# EAGLE design Debug Module (EAGLE 6.3)
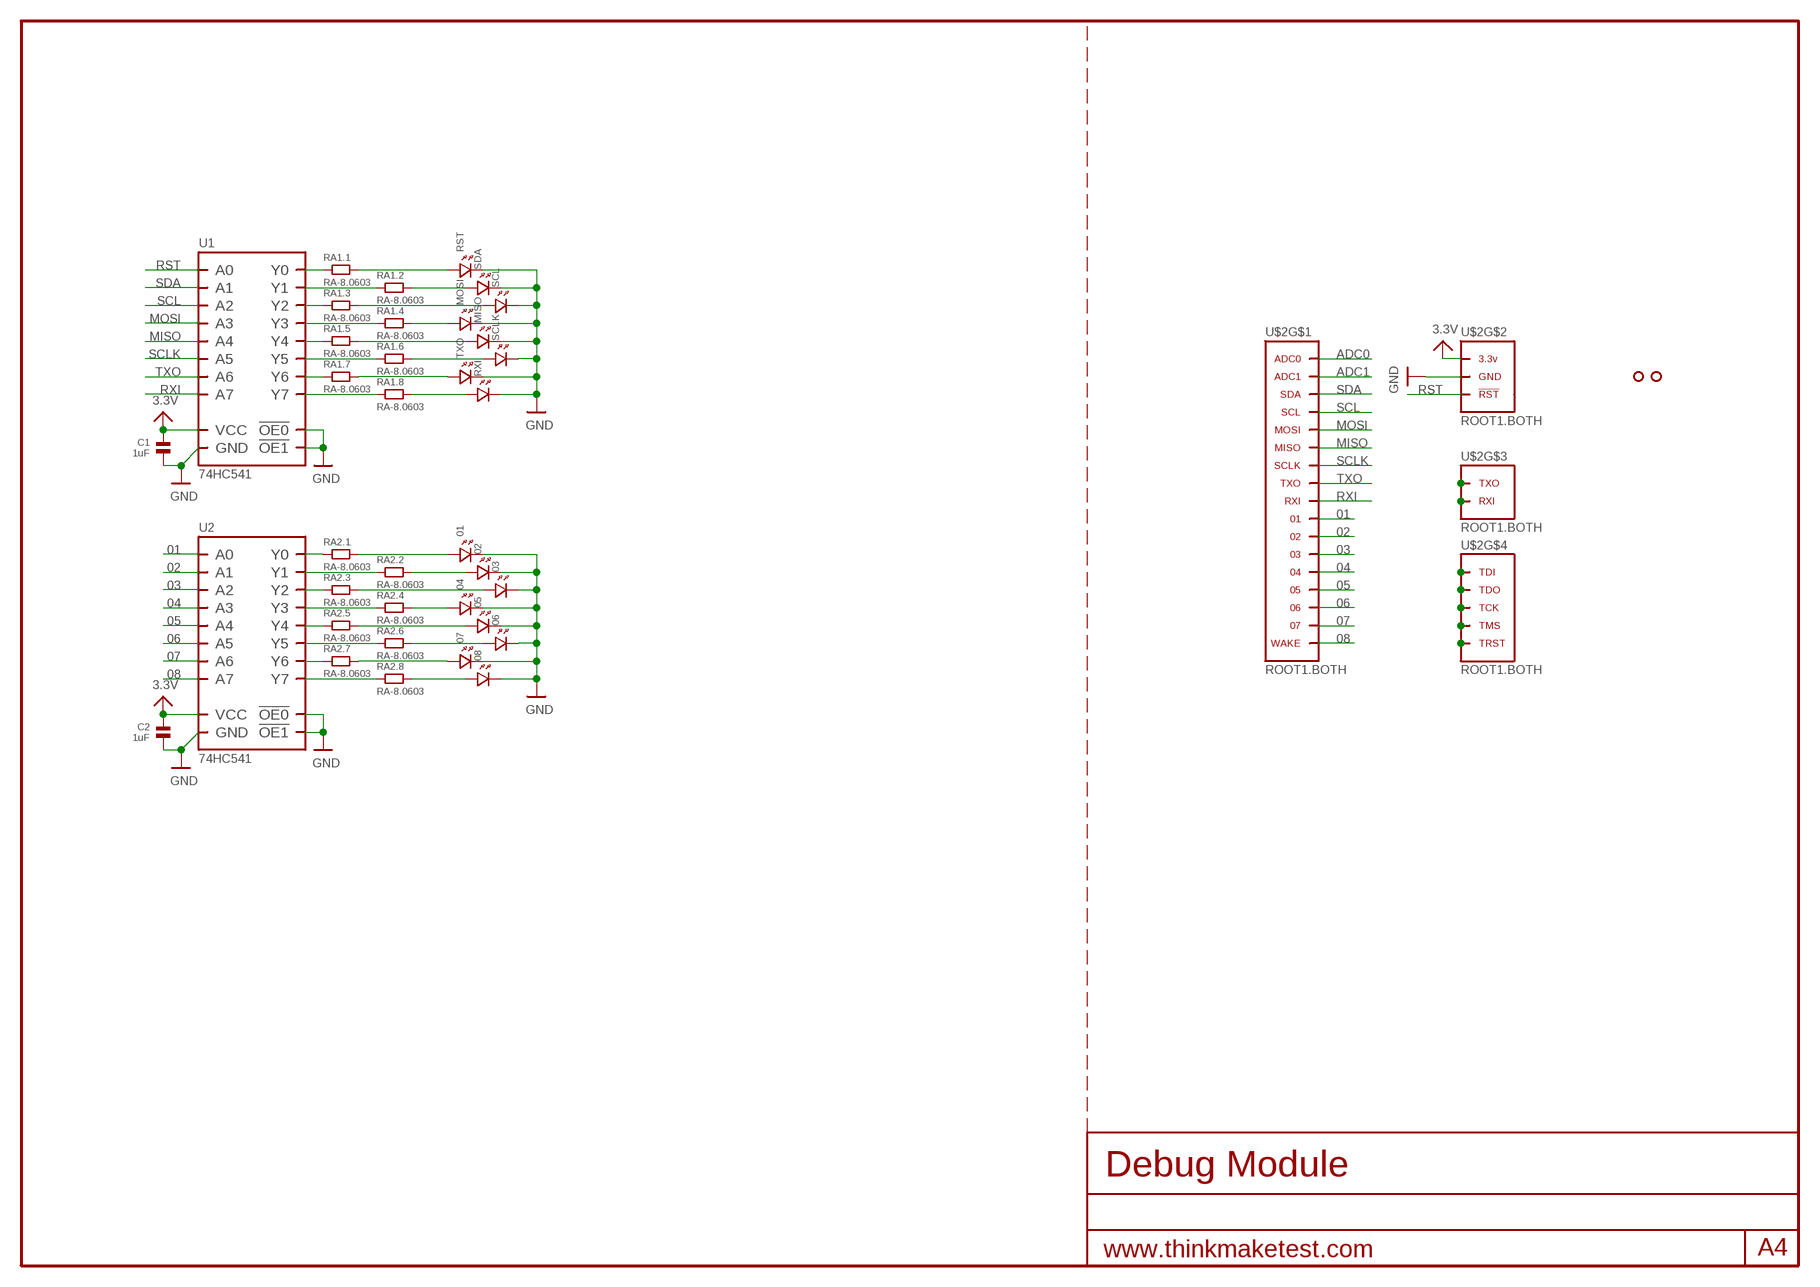
[diagram p0: schematic, sheet 1]

## Parts
01  LED.0603  [0603.LED]
02  LED.0603  [0603.LED]
03  LED.0603  [0603.LED]
04  LED.0603  [0603.LED]
05  LED.0603  [0603.LED]
06  LED.0603  [0603.LED]
07  LED.0603  [0603.LED]
08  LED.0603  [0603.LED]
C1  1uF  CAPACITOR.0603  [0603]
C2  1uF  CAPACITOR.0603  [0603]
MISO  LED.0603  [0603.LED]
MOSI  LED.0603  [0603.LED]
RA1  RA-8.0603  [0603.8.C]
RA2  RA-8.0603  [0603.8.C]
RST  LED.0603  [0603.LED]
RXI  LED.0603  [0603.LED]
SCL  LED.0603  [0603.LED]
SCLK  LED.0603  [0603.LED]
SDA  LED.0603  [0603.LED]
TXO  LED.0603  [0603.LED]
U1  74HC541  [DHVQFN20]
U2  74HC541  [DHVQFN20]
U$2  ROOT1.BOTH  [ROOT1.BOTH]
U$3  HOLE.2MM  [2MM]
U$4  HOLE.2MM  [2MM]

## Nets
01: U2.2(A0) U$2.01 U$2.01@1 U$2.01@VIA
02: U2.3(A1) U$2.02 U$2.02@1 U$2.02@VIA
03: U2.4(A2) U$2.03 U$2.03@1 U$2.03@VIA
3.3V: C1.1 C2.1 U1.20(VCC) U2.20(VCC) U$2.3.3V@1(3.3V) U$2.3.3V@2(3.3V) U$2.3.3V@3(3.3V) U$2.3.3V@4(3.3V) U$2.3.3V@5(3.3V) U$2.3.3V@6(3.3V) U$2.3.3V@7(3.3V) U$2.3.3V@8(3.3V) U$2.3.3V@9(3.3V) U$2.3.3V@10(3.3V) U$2.3.3V@11(3.3V) U$2.3.3V@12(3.3V) U$2.3.3V@13(3.3V) U$2.3.3V@14(3.3V) U$2.3.3V@15(3.3V) U$2.3.3V@16(3.3V) U$2.3.3V@17(3.3V) U$2.3.3V@18(3.3V) U$2.3.3V@19(3.3V) U$2.3.3V@20(3.3V) U$2.3.3V@21(3.3V) U$2.3.3V@22(3.3V) U$2.3.3V@23(3.3V) U$2.3.3V@24(3.3V) U$2.3.3V@VIA(3.3V)
04: U2.5(A3) U$2.04 U$2.04@1 U$2.04@VIA
05: U2.6(A4) U$2.05 U$2.05@1 U$2.05@VIA
06: U2.7(A5) U$2.06 U$2.06@1 U$2.06@VIA
07: U2.8(A6) U$2.07 U$2.07@1 U$2.07@VIA
08: U2.9(A7) U$2.WAKE U$2.WAKE@1(WAKE) U$2.WAKE@VIA(WAKE)
ADC0: U$2.ADC0 U$2.ADC0@1(ADC0) U$2.ADC0@VIA(ADC0)
ADC1: U$2.ADC1 U$2.ADC1@1(ADC1) U$2.ADC1@VIA(ADC1)
GND: 01.P$2 02.P$2 03.P$2 04.P$2 05.P$2 06.P$2 07.P$2 08.P$2 C1.2 C2.2 MISO.P$2 MOSI.P$2 RST.P$2 RXI.P$2 SCL.P$2 SCLK.P$2 SDA.P$2 TXO.P$2 U1.1(!OE0!) U1.10(GND) U1.19(!OE1!) U1.PAD(GND) U2.1(!OE0!) U2.10(GND) U2.19(!OE1!) U2.PAD(GND) U$2.GND@1(GND) U$2.GND@2(GND) U$2.GND@3(GND) U$2.GND@4(GND) U$2.GND@5(GND) U$2.GND@6(GND) U$2.GND@7(GND) U$2.GND@8(GND) U$2.GND@9(GND) U$2.GND@10(GND) U$2.GND@11(GND) U$2.GND@12(GND) U$2.GND@13(GND) U$2.GND@14(GND) U$2.GND@15(GND) U$2.GND@16(GND) U$2.GND@17(GND) U$2.GND@18(GND) U$2.GND@19(GND) U$2.GND@20(GND) U$2.GND@21(GND) U$2.GND@22(GND) U$2.GND@23(GND) U$2.GND@24(GND) U$2.GND@25(GND) U$2.GND@26(GND) U$2.GND@VIA(GND)
MISO: U1.6(A4) U$2.MISO U$2.MISO@1(MISO) U$2.MISO@VIA(MISO)
MOSI: U1.5(A3) U$2.MOSI U$2.MOSI@1(MOSI) U$2.MOSI@VIA(MOSI)
N$1: U$2.TXO.DBG(TXO) U$2.TXO.DBG@1(TXO) U$2.TXO.DBG@VIA(TXO)
N$2: RA2.1 U2.18(Y0)
N$3: RA2.3 U2.17(Y1)
N$4: RA2.5 U2.16(Y2)
N$5: RA2.7 U2.15(Y3)
N$6: RA2.9 U2.14(Y4)
N$7: RA2.11 U2.13(Y5)
N$8: RA2.13 U2.12(Y6)
N$9: RA2.15 U2.11(Y7)
N$10: 07.P$1 RA2.14
N$11: 08.P$1 RA2.16
N$12: 06.P$1 RA2.12
N$13: 05.P$1 RA2.10
N$14: 04.P$1 RA2.8
N$15: 03.P$1 RA2.6
N$16: 02.P$1 RA2.4
N$17: 01.P$1 RA2.2
N$18: U$2.RXI.DBG(RXI) U$2.RXI.DBG@1(RXI) U$2.RXI.DBG@VIA(RXI)
N$19: U$2.TDI U$2.TDI@1(TDI) U$2.TDI@VIA(TDI)
N$20: U$2.TCK U$2.TCK@1(TCK) U$2.TCK@VIA(TCK)
N$21: U$2.TDO U$2.TDO@1(TDO) U$2.TDO@VIA(TDO)
N$22: U$2.TMS U$2.TMS@1(TMS) U$2.TMS@VIA(TMS)
N$23: U$2.TRST U$2.TRST@1(TRST) U$2.TRST@VIA(TRST)
N$51: RA1.1 U1.18(Y0)
N$52: RA1.3 U1.17(Y1)
N$53: RA1.5 U1.16(Y2)
N$54: RA1.7 U1.15(Y3)
N$55: RA1.9 U1.14(Y4)
N$56: RA1.11 U1.13(Y5)
N$57: RA1.13 U1.12(Y6)
N$58: RA1.15 U1.11(Y7)
N$59: RA1.14 TXO.P$1
N$60: RA1.16 RXI.P$1
N$61: RA1.12 SCLK.P$1
N$62: MISO.P$1 RA1.10
N$63: MOSI.P$1 RA1.8
N$64: RA1.6 SCL.P$1
N$65: RA1.4 SDA.P$1
N$66: RA1.2 RST.P$1
RST: U1.2(A0) U$2.RST(!RST) U$2.RST@1(!RST) U$2.RST@VIA(!RST)
RXI: U1.9(A7) U$2.RXI U$2.RXI@1(RXI) U$2.RXI@VIA(RXI)
SCL: U1.4(A2) U$2.SCL U$2.SCL@1(SCL) U$2.SCL@VIA(SCL)
SCLK: U1.7(A5) U$2.SCLK U$2.SCLK@1(SCLK) U$2.SCLK@VIA(SCLK)
SDA: U1.3(A1) U$2.SDA U$2.SDA@1(SDA) U$2.SDA@VIA(SDA)
TXO: U1.8(A6) U$2.TXO U$2.TXO@1(TXO) U$2.TXO@VIA(TXO)

## Library data of the parts
01-08 MISO MOSI RST RXI SCL SCLK SDA TXO = .standardparts:LED
C1 C2 = .standardparts:CAPACITOR
RA1 RA2 = .resistorarray:RA-8
U1 U2 = nxp:74HC541
U$2 = thinkmaketest:ROOT1
U$3 U$4 = .screw_holes:HOLE

## Board
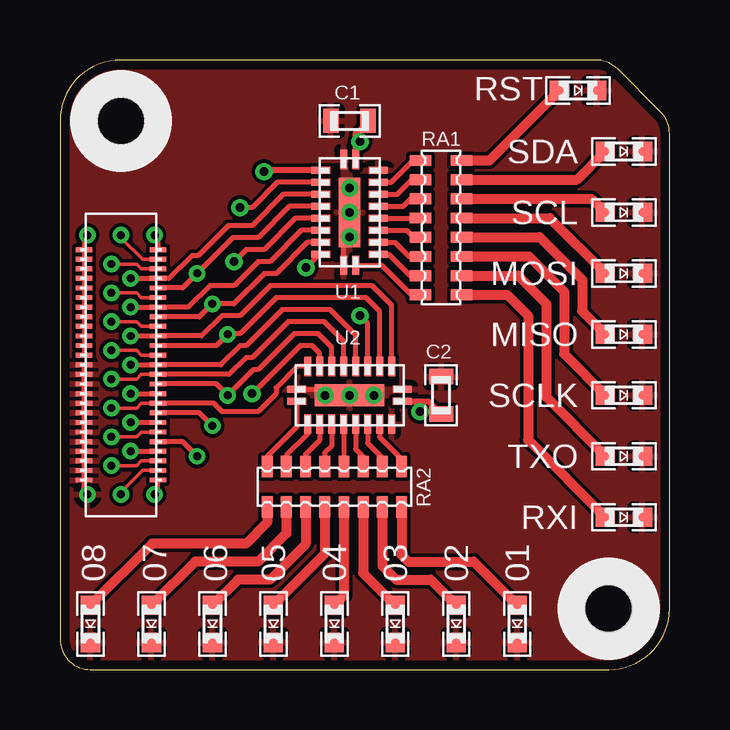
[diagram p1: board, top side]
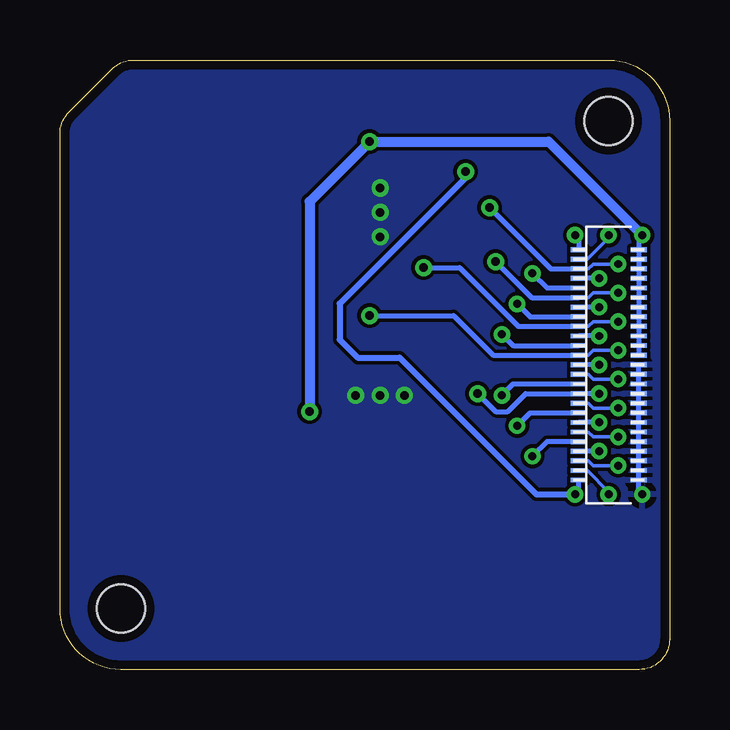
[diagram p2: board, bottom side, seen from below]

Size 25.4 x 25.4 mm. Coordinates in mm from the lower left corner, seen from the top.
Outline: 0,22.86 0,1.27 arc90 1.27,0 22.86,0 arc90 25.4,2.54 25.4,22.33 arc45 25.03,23.23 23.23,25.03 arc45 22.33,25.4 2.54,25.4 arc90 0,22.86
Copper layers (1*16): Top 0.0356mm / dielectric 1.5011mm / Bottom 0.0356mm
Design rules "default": minimum track width 6mil, minimum drill 13mil, track to track 6mil, track to pad 6mil, pad to pad 6mil, via to via 6mil, smd to smd 6mil, copper to edge 15mil, drill to drill 6mil, minimum pad ring 7mil, minimum via ring 7mil, stop-mask expansion 4mil, vias tented up to drill 16mil, thermal gap 10mil

### Footprints (pad centres in the part's own frame; a part is rotated, then mirrored left to right if it is on the bottom)
0603.LED = smd 0.8 x 0.8: P$1 -0.775,0; P$2 0.775,0
0603 = smd 0.65 x 1: 1 -0.775,0; 2 0.775,0
0603.8.C = smd 0.45 x 0.9: 1 -2.8,-0.85; 2 -2.8,0.85; 3 -2,-0.85; 4 -2,0.85; 5 -1.2,-0.85; 6 -1.2,0.85; 7 -0.4,-0.85; 8 -0.4,0.85; 9 0.4,-0.85; 10 0.4,0.85; 11 1.2,-0.85; 12 1.2,0.85; 13 2,-0.85; 14 2,0.85; 15 2.8,-0.85; 16 2.8,0.85
DHVQFN20 = smd 0.8 x 0.29: 1 -2.2,-0.25; 10 2.2,-0.25; 11 2.2,0.25; 20 -2.2,0.25 | smd 0.29 x 0.8: 2 -1.75,-1.2; 3 -1.25,-1.2; 4 -0.75,-1.2; 5 -0.25,-1.2; 6 0.25,-1.2; 7 0.75,-1.2; 8 1.25,-1.2; 9 1.75,-1.2; 12 1.75,1.2; 13 1.25,1.2; 14 0.75,1.2; 15 0.25,1.2; 16 -0.25,1.2; 17 -0.75,1.2; 18 -1.25,1.2; 19 -1.75,1.2 | smd 2.9 x 0.9: PAD 0,0
ROOT1.BOTH = smd 0.66 x 0.2 bottom: 01 3.795,13.9; 02 3.795,13.5; 03 3.795,13.1; 3.3V@1 1.285,17.5; 3.3V@2 1.285,17.1; 3.3V@3 1.285,16.7; 3.3V@4 1.285,16.3; 3.3V@5 1.285,15.9; 3.3V@6 1.285,15.5; 3.3V@7 1.285,15.1; 3.3V@8 1.285,14.7; 3.3V@9 1.285,14.3; 3.3V@10 1.285,13.9; 3.3V@11 1.285,13.5; 3.3V@12 1.285,13.1; 04 3.795,12.7; 05 3.795,12.3; 06 3.795,11.9; 07 3.795,11.5; ADC0 3.795,17.5; ADC1 3.795,17.1; GND@1 1.285,7.9; GND@2 1.285,8.3; GND@3 1.285,8.7; GND@4 1.285,9.1; GND@5 1.285,9.5; GND@6 1.285,9.9; GND@7 1.285,10.3; GND@8 1.285,10.7; GND@9 1.285,11.1; GND@10 1.285,11.5; GND@11 1.285,11.9; GND@12 1.285,12.3; GND@13 1.285,12.7; MISO 3.795,15.5; MOSI 3.795,15.9; RST 3.795,7.9; RXI 3.795,14.3; RXI.DBG 3.795,10.3; SCL 3.795,16.3; SCLK 3.795,15.1; SDA 3.795,16.7; TCK 3.795,9.1; TDI 3.795,9.9; TDO 3.795,9.5; TMS 3.795,8.7; TRST 3.795,8.3; TXO 3.795,14.7; TXO.DBG 3.795,10.7; WAKE 3.795,11.1 | smd 0.7 x 0.2: 01@1 4.08,13.9; 02@1 4.08,13.5; 3.3V@13 1,17.5; 3.3V@14 1,17.1; 3.3V@15 1,16.7; 3.3V@16 1,16.3; 3.3V@17 1,15.9; 3.3V@18 1,15.5; 3.3V@19 1,15.1; 3.3V@20 1,14.7; 3.3V@21 1,14.3; 3.3V@22 1,13.9; 3.3V@23 1,13.5; 3.3V@24 1,13.1; 03@1 4.08,13.1; 04@1 4.08,12.7; 05@1 4.08,12.3; 06@1 4.08,11.9; 07@1 4.08,11.5; ADC0@1 4.08,17.5; ADC1@1 4.08,17.1; GND@14 1,7.9; GND@15 1,8.3; GND@16 1,8.7; GND@17 1,9.1; GND@18 1,9.5; GND@19 1,9.9; GND@20 1,10.3; GND@21 1,10.7; GND@22 1,11.1; GND@23 1,11.5; GND@24 1,11.9; GND@25 1,12.3; GND@26 1,12.7; MISO@1 4.08,15.5; MOSI@1 4.08,15.9; RST@1 4.08,7.9; RXI.DBG@1 4.08,10.3; RXI@1 4.08,14.3; SCL@1 4.08,16.3; SCLK@1 4.08,15.1; SDA@1 4.08,16.7; TCK@1 4.08,9.1; TDI@1 4.08,9.9; TDO@1 4.08,9.5; TMS@1 4.08,8.7; TRST@1 4.08,8.3; TXO.DBG@1 4.08,10.7; TXO@1 4.08,14.7; WAKE@1 4.08,11.1 | drill 0.33 pad 0.686: 01@VIA 2.94,13.9; 02@VIA 6.985,13.97; 3.3V@VIA 1.14,18.1; 03@VIA 2.14,13.3; 04@VIA 2.94,12.7; 05@VIA 2.14,12.1; 06@VIA 6.985,11.43; 07@VIA 2.94,11.5; ADC0@VIA 3.94,18.1; ADC1@VIA 2.54,18.1; GND@VIA 1.14,7.3; MISO@VIA 2.14,15.7; MOSI@VIA 5.715,16.51; RST@VIA 3.94,7.3; RXI.DBG@VIA 2.94,10.3; RXI@VIA 2.14,14.5; SCL@VIA 2.94,16.3; SCLK@VIA 2.94,15.1; SDA@VIA 2.14,16.9; TCK@VIA 2.94,9.1; TDI@VIA 2.14,9.7; TDO@VIA 5.715,8.89; TMS@VIA 2.14,8.5; TRST@VIA 2.54,7.3; TXO.DBG@VIA 6.35,10.16; TXO@VIA 6.35,15.24; WAKE@VIA 2.14,10.9
2MM = hole 2: 0,0

### Placement (x,y rotation side)
01  19.05,1.91 270 top
02  16.51,1.91 270 top
03  13.97,1.91 270 top
04  11.43,1.91 270 top
05  8.89,1.91 270 top
06  6.35,1.91 270 top
07  3.81,1.91 270 top
08  1.27,1.91 270 top
C1  12.06,22.86 180 top
C2  15.88,11.43 90 top
MISO  23.5,13.97 0 top
MOSI  23.5,16.51 0 top
RA1  15.88,18.41 270 top
RA2  11.43,7.62 180 top
RST  21.59,24.13 0 top
RXI  23.5,6.35 0 top
SCL  23.5,19.05 0 top
SCLK  23.5,11.43 0 top
SDA  23.5,21.59 0 top
TXO  23.5,8.89 0 top
U1  12.06,19.05 270 top
U2  12.06,11.43 180 top
U$2  0,0 0 top
U$3  22.86,2.54 90 top
U$4  2.54,22.86 90 top

### Tracks (layer width: path | path; a pad name or v marks a point on that pad's centre or on a via)
01
  Top 0.203: U2.2 13.81,15.19 13,16 8.75,16 7.5,14.75 6.75,14.75 5.9,13.9 U$2.01@1
02
  Top 0.203: U2.3 13.31,14.94 12.75,15.5 9,15.5 7.5,14 7.01,14 U$2.02@VIA
03  (via drill 0.36)
  Top 0.203: U2.4 12.81,14.44 v12.5,14.75
  Bottom 0.203: v12.5,14.75 9,14.75 7.35,13.1 U$2.03
3.3V  (via drill 0.36)
  Top 0.254: U2.20 15,11.18 | 15,11.18 15.35,11.18 C2.1 | C1.1 12.31,22.34 U1.20 12.31,22 v12.5,22 | v15,10.75 15,11.18
  Bottom 0.406: U$2.3.3V@VIA 5.04,22 v12.5,22 15,19.5 v15,10.75
04
  Top 0.203: U2.5 12.31,13.94 11.25,15 9.25,15 7.75,13.5 7.5,13.5 6.7,12.7 U$2.04@1
05
  Top 0.203: U2.6 11.81,13.69 11,14.5 9.5,14.5 8,13 7.75,13 7.05,12.3 U$2.05@1
06
  Top 0.203: U2.7 11.31,13.44 10.75,14 9.75,14 8.25,12.5 8.05,12.5 U$2.06@VIA
07  (via drill 0.36)
  Top 0.203: U2.8 10.81,13.19 10.5,13.5 10,13.5 v8,11.5
  Bottom 0.203: v8,11.5 7.25,10.75 6.75,10.75 6,11.5 U$2.07
08
  Top 0.203: U2.9 9.88,12.63 9,11.75 9,11.5 8.25,10.75 6.75,10.75 6.4,11.1 U$2.WAKE@1
GND  (via drill 0.36)
  Top 0.203: U2.10 11.81,11.68 U2.PAD | U1.10 11.81,18.8 U1.PAD
  other vias: 12.06,11.43 12.06,19.05 12.06,20.07 12.06,18.03 11.05,11.43 13.08,11.43
  pour Bottom (rank 6): 0,0 25.4,0 25.4,25.4 0,25.4
  pour Top (rank 6): 0,0 25.4,0 25.4,25.4 0,25.4
MISO  (via drill 0.36)
  Top 0.203: U1.6 9.8,18.8 8.5,17.5 7.75,17.5 v7.25,17
  Bottom 0.203: v7.25,17 5.75,15.5 U$2.MISO
MOSI
  Top 0.203: U1.5 9.55,19.3 8.25,18 7.21,18 U$2.MOSI@VIA
N$2
  Top 0.203: U2.18 13.31,9.69 14.23,8.77 RA2.1
N$3
  Top 0.203: U2.17 12.81,9.44 13.43,8.82 RA2.3
N$4
  Top 0.203: U2.16 12.31,9.19 12.63,8.87 RA2.5
N$5
  Top 0.203: U2.15 11.81,8.48 RA2.7
N$6
  Top 0.203: U2.14 11.31,9.31 11.03,9.03 RA2.9
N$7
  Top 0.203: U2.13 10.81,9.56 10.23,8.98 RA2.11
N$8
  Top 0.203: U2.12 10.31,9.81 9.43,8.93 RA2.13
N$9
  Top 0.203: U2.11 9.87,10.12 8.63,8.88 RA2.15
N$10
  Top 0.406: RA2.14 9.43,5.68 8.25,4.5 5.63,4.5 07.P$1
N$11
  Top 0.406: RA2.16 8.63,6.13 7.75,5.25 3.84,5.25 08.P$1
N$12
  Top 0.406: RA2.12 10.23,5.23 8.75,3.75 7.42,3.75 06.P$1
N$13
  Top 0.406: RA2.10 11.03,4.82 05.P$1
N$14
  Top 0.406: RA2.8 11.83,3.08 04.P$1
N$15
  Top 0.406: RA2.6 12.63,4.02 03.P$1
N$16
  Top 0.406: RA2.4 13.43,4.32 14,3.75 15.44,3.75 02.P$1
N$17
  Top 0.406: RA2.2 14.23,4.77 14.5,4.5 17.23,4.5 01.P$1
N$51
  Top 0.203: U1.18 13.8,20.3 14.71,21.21 RA1.1
N$52
  Top 0.203: U1.17 14.05,19.8 14.66,20.41 RA1.3
N$53
  Top 0.203: U1.16 14.3,19.3 14.62,19.61 RA1.5
N$54
  Top 0.203: U1.15 15.01,18.8 RA1.7
N$55
  Top 0.203: U1.14 14.45,18.3 14.73,18.02 RA1.9
N$56
  Top 0.203: U1.13 13.95,17.8 14.54,17.21 RA1.11
N$57
  Top 0.203: U1.12 13.7,17.3 14.59,16.41 RA1.13
N$58
  Top 0.203: U1.11 13.4,16.85 14.63,15.62 RA1.15
N$59
  Top 0.406: RA1.14 19.09,16.41 20.25,15.25 20.25,11.36 TXO.P$1
N$60
  Top 0.406: RA1.16 18.64,15.62 19.5,14.75 19.5,9.57 RXI.P$1
N$61
  Top 0.406: RA1.12 19.54,17.21 21,15.75 21,13.15 SCLK.P$1
N$62
  Top 0.406: RA1.10 19.98,18.02 21.75,16.25 21.75,14.94 MISO.P$1
N$63
  Top 0.406: RA1.8 20.41,18.82 MOSI.P$1
N$64
  Top 0.406: RA1.6 22.16,19.61 SCL.P$1
N$65
  Top 0.406: RA1.4 21.55,20.41 SDA.P$1
N$66
  Top 0.406: RA1.2 17.9,21.21 RST.P$1
RST  (via drill 0.36)
  Top 0.254: U1.2 8.55,20.8 v8.5,20.75
  Bottom 0.254: v8.5,20.75 8.5,20.5 13.75,15.25 13.75,13.75 13,13 11.25,13 5.55,7.3 U$2.RST@VIA
RXI  (via drill 0.36)
  Top 0.203: U1.9 10.8,17.3 v10.25,16.75
  Bottom 0.203: v10.25,16.75 8.75,16.75 6.3,14.3 U$2.RXI
SCL
  Top 0.203: U1.4 9.3,19.8 8,18.5 7,18.5 5.75,17.25 5.5,17.25 4.55,16.3 U$2.SCL@1
SCLK
  Top 0.203: U1.7 10.05,18.3 8.75,17 8.25,17 7.25,16 6.25,16 5.35,15.1 U$2.SCLK@1
SDA  (via drill 0.36)
  Top 0.203: U1.3 9.05,20.3 8,19.25 v7.5,19.25
  Bottom 0.203: v7.5,19.25 4.95,16.7 U$2.SDA
TXO
  Top 0.203: U1.8 10.3,17.8 9,16.5 8.5,16.5 7.24,15.24 U$2.TXO@VIA

### Text on the board
bDocu: Cruz Monrreal II | v1 | AnomalousMaker.com